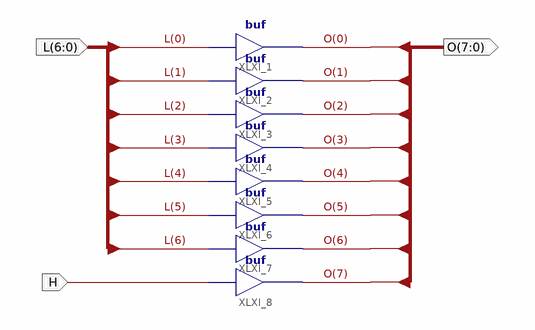
[diagram p0: schematic sheet 1]
// Xilinx ISE schematic splice7x1x8.sch (spartan6) as structural Verilog: 8 symbols, 3 ports
module splice7x1x8 (
  input  [6:0] L,
  input  H,
  output [7:0] O
);

  buf XLXI_1 (O[0], L[0]);
  buf XLXI_2 (O[1], L[1]);
  buf XLXI_3 (O[2], L[2]);
  buf XLXI_4 (O[3], L[3]);
  buf XLXI_5 (O[4], L[4]);
  buf XLXI_6 (O[5], L[5]);
  buf XLXI_7 (O[6], L[6]);
  buf XLXI_8 (O[7], H);
endmodule
